# Altium project AQM with esp32.PrjPcb
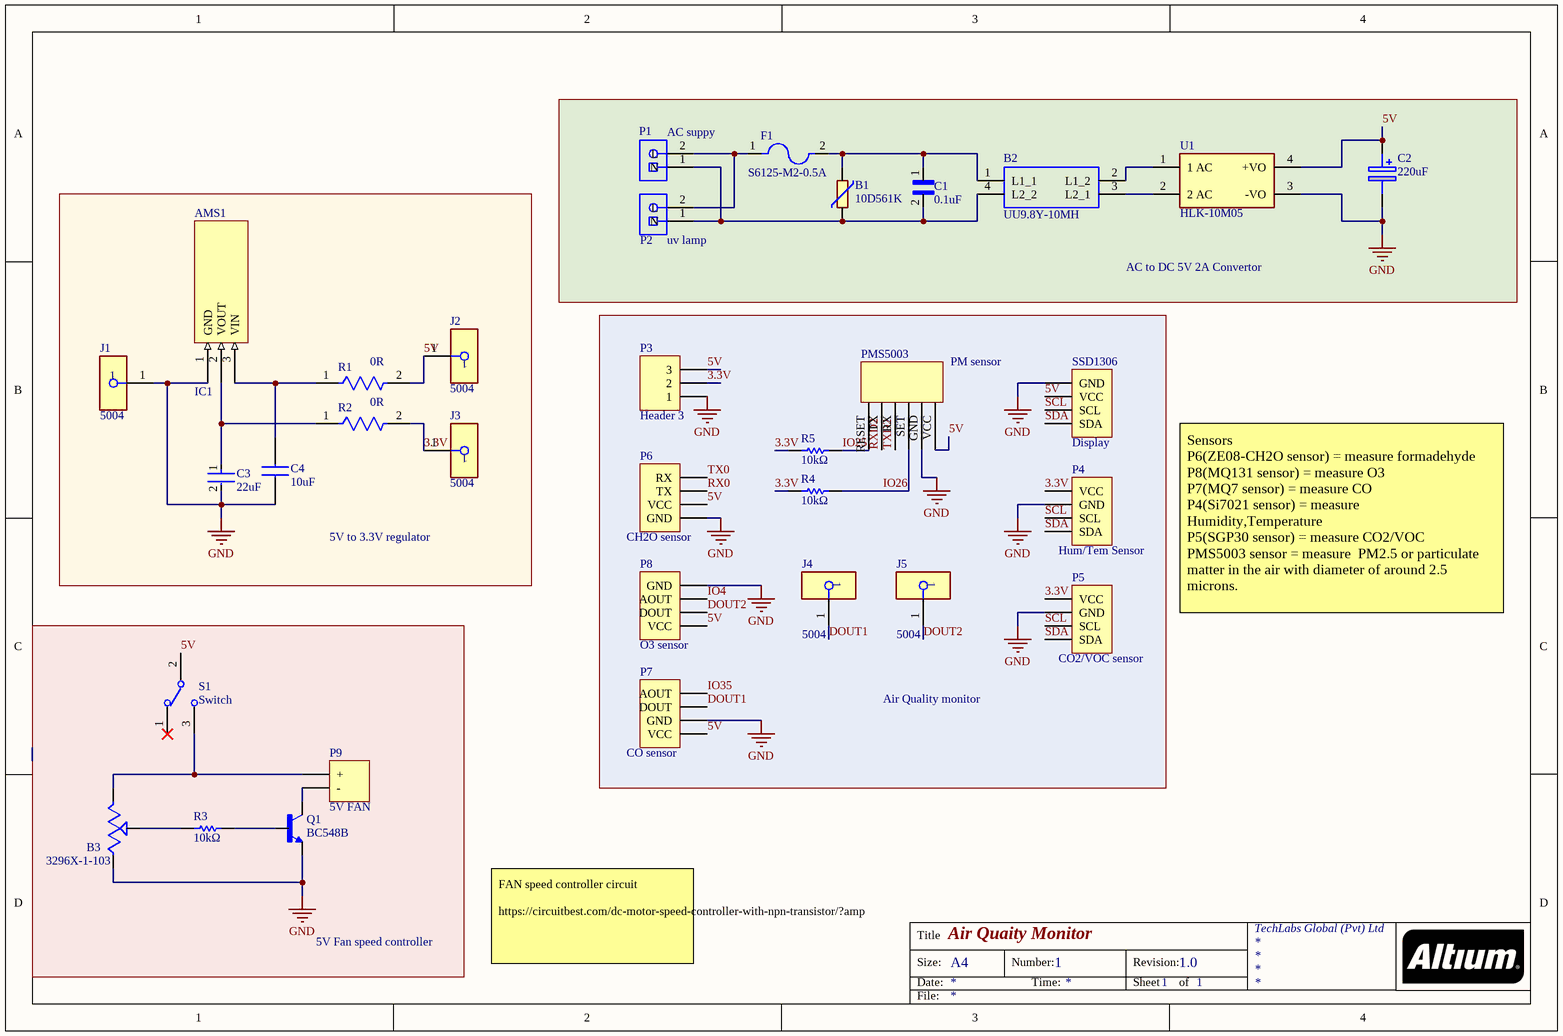
[diagram p0: AQM with esp32.SchDoc]
2 sheets, 72 parts. Net scope: global (net labels, ports and power ports of the same name join across sheets).
Board file: AQM with esp32.PcbDoc
Sheets:
  AQM with esp32.SchDoc
  ESP32 module desing.SchDoc

## Sheet AQM with esp32.SchDoc: Air Quaity Monitor
size A4; Organization: TechLabs Global (Pvt) Ltd; DocumentNumber: 1; Revision: 1.0; SheetNumber: 1; SheetTotal: 1

### Parts
AMS1  IC1  [SOT89-150P350X150-3N]
B1  10D561K  [10D561K]
B2  UU9.8Y-10MH  [UU98Y10MH]
B3  3296X-1-103  [3296X1223LF]
C1  0.1uF  [MPX-104K275VAC-C-D2]
C2  220uF  [CAPAE830X1050N]
C3  22uF  [FP-GRM219-0_2-0_15-IPC_A]
C4  10uF  [CAPC1005X70N]
F1  S6125-M2-0.5A  [CAPC6125X25N]
J1  5004  [FP-5004-MFG]
J2  5004  [FP-5004-MFG]
J3  5004  [FP-5004-MFG]
J4  5004  [FP-5004-MFG]
J5  5004  [FP-5004-MFG]
P1  AC suppy  [PHOE-1729128-2_V]
P2  uv lamp  [PHOE-1729128-2_V]
P3  Header 3  [HDR1X3]
P4  Hum/Tem Sensor  [HDR1X4]
P5  CO2/VOC sensor  [HDR1X4]
P6  CH2O sensor  [HDR1X4]
P7  CO sensor  [HDR1X4]
P8  O3 sensor  [HDR1X4]
P9  5V FAN  [HDR1X2]
PMS5003  PM sensor  [PMS5003 PM2.5 Sensor]
Q1  BC548B  [BC548B]
R1  0R  [FP-RC0402-0_4-IPC_A]
R2  0R  [FP-RC0402-0_4-IPC_A]
R3  10kΩ  [RESC1005X40X25LL05T10]
R4  10kΩ  [RESC1005X40X25LL05T10]
R5  10kΩ  [RESC1005X40X25LL05T10]
S1  Switch  [SK3245SL1A]
SSD1306  Display  [HDR1X4]
U1  HLK-10M05  [FP-HLK-10M05-MFG]

### Blocks framed on the sheet
AC to DC 5V 2A Convertor: B1 B2 C1 C2 F1 P1 P2 U1
5V to 3.3V regulator: AMS1 C3 C4 J1-J3 R1 R2
Air Quality monitor: J4 J5 P3-P8 PMS5003 R4 R5 SSD1306
5V Fan speed controller: B3 P9 Q1 R3 S1

### Nets
GND: AMS1.1(GND) B3.1(A) C2.2(-) C3.2 C4.1 J1.1 P3.1 P4.2(GND) P5.2(GND) P6.1(GND) P7.2(GND) P8.4(GND) PMS5003.GND Q1.3(E) SSD1306.1(GND) U1.3(-VO)
3.3V: J3.1 P3.2 P4.1(VCC) P5.1(VCC) R2.2 R4.1 R5.1
5V: C2.1(+) J2.1 P3.3 P6.2(VCC) P7.1(VCC) P8.1(VCC) PMS5003.VCC R1.2 S1.2 SSD1306.2(VCC) U1.4(+VO)
DOUT1: J4.1 P7.3(DOUT)
DOUT2: J5.1 P8.2(DOUT)
IO4: P8.3(AOUT)
IO25: PMS5003.RESET R5.2
IO26: PMS5003.SET R4.2
IO35: P7.4(AOUT)
RX0: P6.3(TX)
RXD2: PMS5003.TX
SCL: P4.3(SCL) P5.3(SCL) SSD1306.3(SCL)
SDA: P4.4(SDA) P5.4(SDA) SSD1306.4(SDA)
TX0: P6.4(RX)
TXD2: PMS5003.RX
NetAMS1_2: AMS1.2(VOUT) C3.1 R2.1
NetAMS1_3: AMS1.3(VIN) C4.2 R1.1
NetB1_1: B1.1 B2.1(L1_1) C1.1 F1.2
NetB1_2: B1.2 B2.4(L2_2) C1.2 P1.1(N) P2.1(N)
NetB2_2: B2.2(L1_2) U1.1(1_AC)
NetB2_3: B2.3(L2_1) U1.2(2_AC)
NetB3_2: B3.2(B) R3.1
NetB3_3: B3.3(C) P9.1(+) S1.3
NetF1_1: F1.1 P1.2(L) P2.2(L)
NetP9_2: P9.2(-) Q1.1(C)
NetQ1_2: Q1.2(B) R3.2

Not connected (* = marked no-connect by the designer): S1 1*

### Notes on the sheet
- Sensors
  P6(ZE08-CH2O sensor) = measure formadehyde
  P8(MQ131 sensor) = measure O3
  P7(MQ7 sensor) = measure CO
  P4(Si7021 sensor) = measure Humidity,Temperature
  P5(SGP30 sensor) = measure CO2/VOC
  PMS5003 sensor = measure  PM2.5 or particulate matter in the air with diameter of around 2.5 microns.
- FAN speed controller circuit
  https://circuitbest.com/dc-motor-speed-controller-with-npn-transistor/?amp
- Title
- Size:
- Date:
- A4
- Number:
- Time:
- Revision:
- Sheet
- of
- File:

### Library data of the parts
AMS1 = IC?: 75dB@(120Hz) 1A 1.25V@(1A) ±125℃@(Tj) Fixed 3.3V~3.3V Positive 1 20V SOT-89 Linear Voltage Regulators (LDO) ROHS; Manufacturer: YONGYUTAI; Mfr. Part #: AMS1117-3.3; LCSC Part #: C2904742; Package: SOT-89; Datasheet: https://datasheet.lcsc.com/lcsc/2110121330_YONGYUTAI-AMS1117-3-3_C2904742.pdf
B1 = 10D561K: 920V 42.3J 180pF@1kHz 460V 350V 504V~616V 2.5kA Plugin Varistors ROHS; Manufacturer: Hongzhi Elec; Datasheet: https://datasheet.lcsc.com/lcsc/1811141751_Hongzhi-Elec-10D561K_C113236.pdf; LCSC Part #: C113236; Mfr. Part #: 10D561K; Package: Plugin
B2 = UU9.8Y-10MH: 10mH@1kHz 1.2Ω 2 500mA 50V Plugin Common Mode Filters ROHS; Manufacturer: FH (Guangdong Fenghua Advanced Tech); Mfr.Part #: UU9.8Y-10MH; Package: Plugin; Datasheet: https://datasheet.lcsc.com/lcsc/1810311213_FH--Guangdong-Fenghua-Advanced-Tech-UU9-8Y-10mH_C75192.pdf; LCSC Part#: C75192
B3 = 3296X-1-103: ±10% 10kΩ Plugin Variable Resistors/Potentiometers ROHS; Manufacturer: BOCHEN(Chengdu Guosheng Tech); Mfr. Part #: 3296X-1-103; Package: Plugin; LCSC Part #: C118955; Datasheet: https://datasheet.lcsc.com/lcsc/1811011704_BOCHEN-Chengdu-Guosheng-Tech-3296X-1-103_C118955.pdf
C1 = MPX-104K275VAC-C-D2: 0.1uF ±10% -40℃~+110℃ X2 275VAC Radial Leaded,P=15mm Suppression Capacitors ROHS; Manufacturer: CORETONG; LCSC Part #: C3249976; Package: Radial Leaded,P=15mm; Datasheet: https://datasheet.lcsc.com/lcsc/2207051802_CORETONG-MPX-104K275VAC-C-D2_C3249976.pdf; Mfr. Part #: MPX-104K275VAC-C-D2; Value: 0.1uF
C2 = UUR1C221MNL1GS: -40℃~+85℃ 2000hrs@85℃ 220uF 10mm 16V 8mm 215mA@120Hz ±20% SMD,D8xL10mm Aluminum Electrolytic Capacitors - SMD ROHS; Manufacturer: Nichicon; Mfr.Part #: UUR1C221MNL1GS; Package: SMD,D8xL10mm; Datasheet: https://datasheet.lcsc.com/lcsc/2002121532_Nichicon-UUR1C221MNL1GS_C445237.pdf; LCSC Part#: C445237; Value: 220uF
C3 = CMP-06035-056251-1: Chip Multilayer Ceramic Capacitors for General Purpose, 0805, 22uF, X5R, 15%, 20%, 16V; Mfr. Part #: GRM219R61C226ME15L; Manufacturer: Murata Electronics; value: 22uF; Datasheet: https://datasheet.lcsc.com/lcsc/1811141821_Murata-Electronics-GRM219R61C226ME15L_C162295.pdf; LCSC Part #: C162295; Package: 0805
C4 = CL05A106MQ5NUNC: 6.3V 10uF X5R ±20% 0402 Multilayer Ceramic Capacitors MLCC - SMD/SMT ROHS; Manufacturer: Samsung Electro-Mechanics; Mfr. Part #: CL05A106MQ5NUNC; LCSC Part #: C15525; value: 10uF; Datasheet Link: https://datasheet.datasheetarchive.com/originals/distributors/Datasheets-DGA10/2406160.pdf; Package: 0402
F1 = S6125-M2-0.5A: SMD Fuses ROHS; Manufacturer: SART(Nanjing Sart Tech); LCSC Part #: C845172; Mfr. Part #: S6125-M2-0.5A; Package: SMD; Datasheet: https://datasheet.lcsc.com/lcsc/2201242130_SART-Nanjing-Sart-Tech-S6125-M2-0-5A_C845172.pdf
J1-J5 = CMP-2000-05575-2: PC TEST POINT MINIATURE YELLOW; Manufacturer: Keystone; Datasheet: https://datasheet.lcsc.com/lcsc/2201121200_Keystone-5004_C2906762.pdf; LCSC Part #: C2906762; ComponentLink2URL: https://www.keyelco.com/product-pdf.cfm?p=1313; ComponentLink2Description: Datasheet; Package: 5004; Mfr. Part #: 5004
P1 P2 = CMP-2000-05815-1: 13.5A 400V Green Straight pin 5.08mm 1 2 Plugin,P=5.08mm Screw terminal ROHS; Mfr.Part #: 1729128; Manufacturer: Phoenix Contact; Datasheet: https://www.farnell.com/datasheets/2617011.pdf; LCSC Part#: C91153; Package: Plugin,P=5.08mm
P3 = Header 3: Header, 3-Pin; LatestRevisionDate: 17-Jul-2002; LatestRevisionNote: Re-released for DXP Platform.; Publisher: Altium Limited
P4 = Header 4: Si7021 Header, 4-Pin
P5 = Header 4: SGP30 Header, 4-Pin; LatestRevisionDate: 17-Jul-2002; LatestRevisionNote: Re-released for DXP Platform.; Publisher: Altium Limited
P6 = Header 4: - Sensor Modules ROHS; Mfr.Part #: ZE08-CH2O; Manufacturer: Zhengzhou Winsen Elec Tech; LCSC Part#: C141344
P7 = Header 4: MQ7 Header, 4-Pin; LatestRevisionDate: 17-Jul-2002; LatestRevisionNote: Re-released for DXP Platform.; Publisher: Altium Limited
P8 = Header 4: MQ131 Header, 4-Pin; LatestRevisionDate: 17-Jul-2002; LatestRevisionNote: Re-released for DXP Platform.; Publisher: Altium Limited
P9 = Header 2: Header, 2-Pin; LatestRevisionDate: 17-Jul-2002; LatestRevisionNote: Re-released for DXP Platform.; Publisher: Altium Limited
PMS5003 = PMS5003 PM2.5 Sensor: PMS5003 Sensor Modules ROHS; Manufacturer: Beijing Plantower; Mfr.Part #: PMS5003; LCSC Part#: C91431; Package: PMS5003; Datasheet: https://datasheet.lcsc.com/lcsc/1810251510_Beijing-Plantower-PMS5003_C91431.pdf
Q1 = BC548B: 100nA 30V 625mW 200@2mA,5V 100mA 150MHz 300mV@100mA,5mA NPN +150℃@(Tj) TO-92-3 Bipolar Transistors - BJT ROHS; Manufacturer: LGE; LCSC Part#: C713615; Mfr.Part #: BC548B; Package: TO-92-3; Datasheet: https://datasheet.lcsc.com/lcsc/2008011835_LGE-BC548B_C713615.pdf
R1 R2 = CMP-2002-07342-2: RES SMD 0 OHM JUMPER 1/16W 0402; Manufacturer: Yageo; Mfr. Part #: RC0402FR-070RL; value: 0R; Package: 0402; LCSC Part #: C106231; Datasheet: https://www.lcsc.com/product-detail/Chip-Resistor-Surface-Mount_YAGEO-RC0402FR-070RL_C106231.html
R3-R5 = CMP-2002-07353-1: 62.5mW 50V ±100ppm/℃ ±1% -55℃~+155℃ 10kΩ 0402 Chip Resistor - Surface Mount ROHS; Mfr. Part #: RC0402FR-0710KL; Manufacturer: Yageo / Phycomp; Datasheet: https://datasheet.lcsc.com/lcsc/1809301715_YAGEO-RC0402FR-0710KL_C60490.pdf; LCSC Part #: C60490; Package: 0402; value: 10kΩ
S1 = SK-3245S-L1-A: Surface Mount 50mA DPDT 3.2mm 12V 9.1mm 12V 3.55mm 50mA 10000 SMDSplicing Rectangular columnar -40℃~+85℃ Black SMD Slide Switches ROHS; Manufacturer: XKB Connectivity; Package: SMD; Datasheet: https://datasheet.lcsc.com/lcsc/2002271841_XKB-Connectivity-SK-3245S-L1-A_C405951.pdf; Mfr. Part #: SK-3245S-L1-A; LCSC Part #: C405951
SSD1306 = Header 4: Header, 4-Pin; LatestRevisionDate: 17-Jul-2002; LatestRevisionNote: Re-released for DXP Platform.; Publisher: Altium Limited
U1 = CMP-218581-000001-1: 5V 2A 90VAC~265VAC 1 120V~350V Isolated Regulated 10W AC-DC 80% Plugin Power Modules ROHS; Manufacturer: HI-LINK; Mfr.Part #: HLK-10M05; LCSC Part#: C403745; Package: Plugin

## Sheet ESP32 module desing.SchDoc
size A4
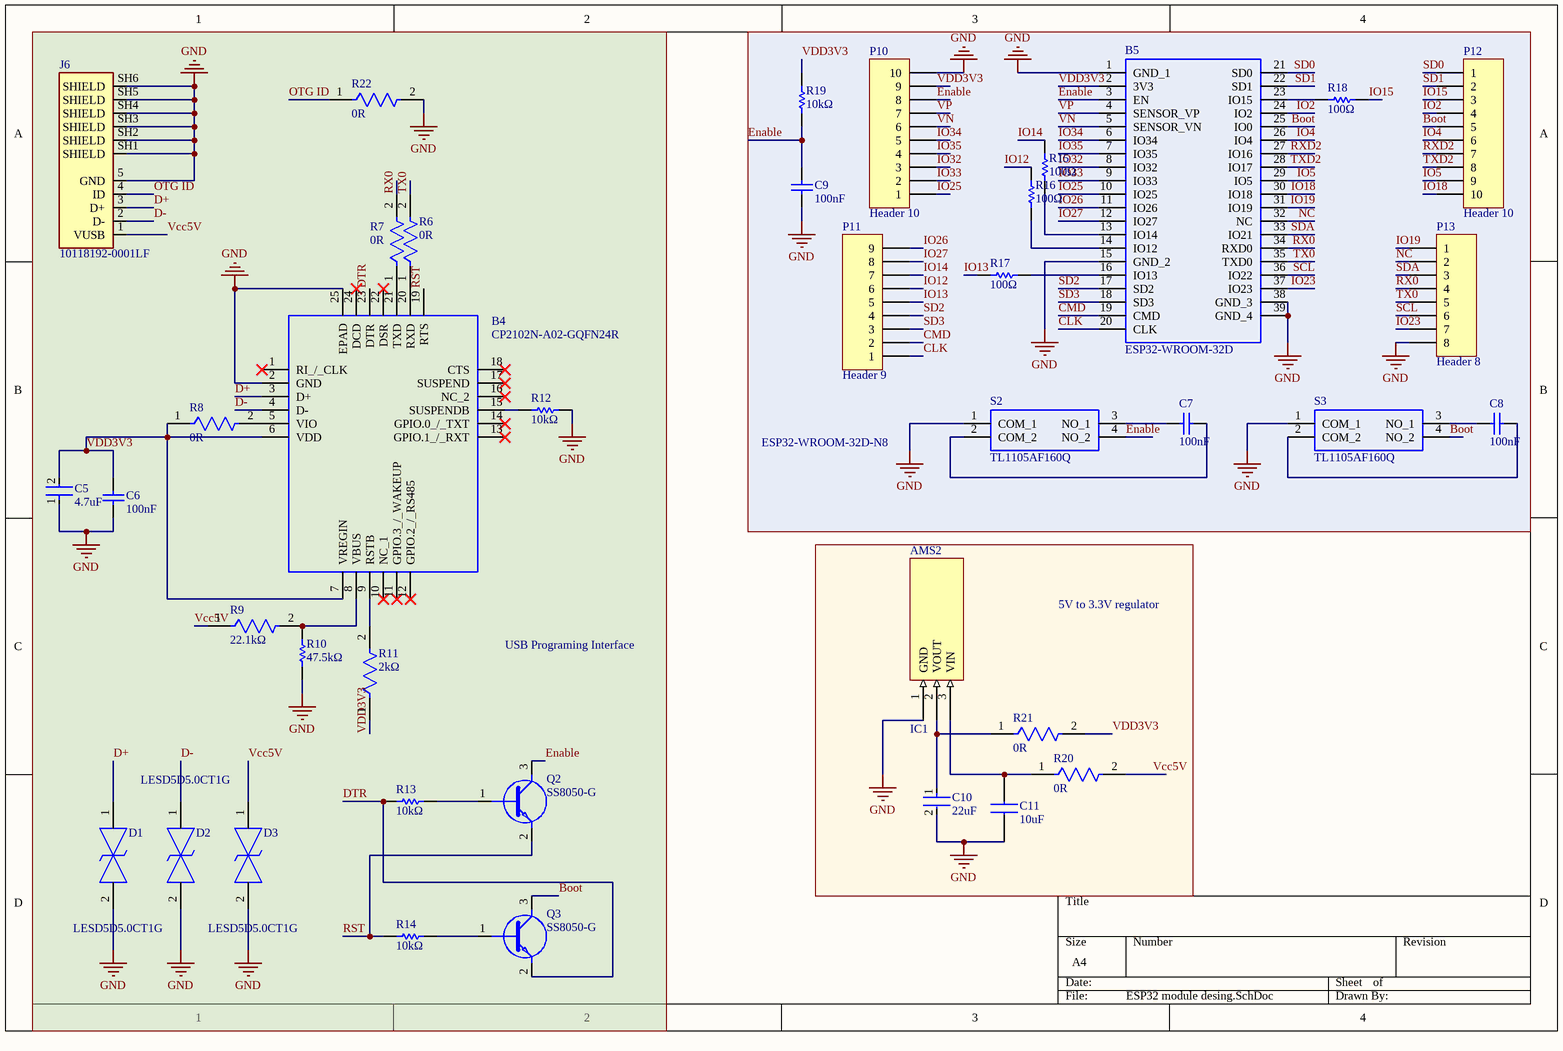
[diagram p1: ESP32 module desing.SchDoc]

### Parts
AMS2  IC1  [SOT89-150P350X150-3N]
B4  CP2102N-A02-GQFN24R  [QFN50P400X400X80-25N-D]
B5  ESP32-WROOM-32D  [ESP32WROOM32D]
C5  4.7uF  [FP-CL21-IPC_A]
C6  100nF  [CAPC1050X55X23ML05T13]
C7  100nF  [CAPC1050X55X23ML05T13]
C8  100nF  [CAPC1050X55X23ML05T13]
C9  100nF  [CAPC1050X55X23ML05T13]
C10  22uF  [FP-GRM219-0_2-0_15-IPC_A]
C11  10uF  [CAPC1005X70N]
D1  LESD5D5.0CT1G  [LESD5D50CT1G]
D2  LESD5D5.0CT1G  [LESD5D50CT1G]
D3  LESD5D5.0CT1G  [LESD5D50CT1G]
J6  10118192-0001LF  [AMPHENOL_10118192-0001LF]
P10  Header 10  [HDR1X10]
P11  Header 9  [HDR1X9]
P12  Header 10  [HDR1X10]
P13  Header 8  [HDR1X8]
Q2  SS8050-G  [SOT95P240X115-3N]
Q3  SS8050-G  [SOT95P240X115-3N]
R6  0R  [FP-RC0402-0_4-IPC_A]
R7  0R  [FP-RC0402-0_4-IPC_A]
R8  0R  [FP-RC0402-0_4-IPC_A]
R9  22.1kΩ  [FP-RC0402-0_4-IPC_B]
R10  47.5kΩ  [RESC1005X40X25NL05T10]
R11  2kΩ  [FP-RC_L0402-MFG]
R12  10kΩ  [RESC1005X40X25LL05T10]
R13  10kΩ  [RESC1005X40X25LL05T10]
R14  10kΩ  [RESC1005X40X25LL05T10]
R15  100Ω  [RESC1005X40X25ML05T10]
R16  100Ω  [RESC1005X40X25ML05T10]
R17  100Ω  [RESC1005X40X25ML05T10]
R18  100Ω  [RESC1005X40X25ML05T10]
R19  10kΩ  [RESC1005X40X25LL05T10]
R20  0R  [FP-RC0402-0_4-IPC_A]
R21  0R  [FP-RC0402-0_4-IPC_A]
R22  0R  [FP-RC0402-0_4-IPC_A]
S2  TL1105AF160Q  [TL1105AF160Q]
S3  TL1105AF160Q  [TL1105AF160Q]

### Blocks framed on the sheet
USB Programing Interface: B4 C5 C6 D1-D3 J6 Q2 Q3 R6-R14 R22
ESP32-WROOM-32D-N8: B5 C7-C9 P10-P13 R15-R19 S2 S3
5V to 3.3V regulator: AMS2 C10 C11 R20 R21

### Nets
GND: AMS2.1(GND) B4.2(GND) B4.25(EPAD) B5.1(GND_1) B5.15(GND_2) B5.38(GND_3) B5.39(GND_4) C5.1 C6.1 C9.2 C10.2 C11.1 D1.2 D2.2 D3.2 J6.5(GND) J6.SH1(SHIELD) J6.SH2(SHIELD) J6.SH3(SHIELD) J6.SH4(SHIELD) J6.SH5(SHIELD) J6.SH6(SHIELD) P10.10 P13.8 R10.1 R12.2 R22.2 S2.1(COM_1) S3.1(COM_1)
Boot: B5.25(IO0) P12.5 Q3.3(C) S3.4(NO_2)
CLK: B5.20(CLK) P11.1
CMD: B5.19(CMD) P11.2
D+: B4.3(D+) D1.1 J6.3(D+)
D-: B4.4(D-) D2.1 J6.2(D-)
DTR: B4.23(DTR) Q3.2(E) R13.1
Enable: B5.3(EN) C9.1 P10.8 Q2.3(C) R19.1 S2.4(NO_2)
IO2: B5.24(IO2) P12.4
IO4: B5.26(IO4) P12.6
IO5: B5.29(IO5) P12.9
IO12: P11.6 R16.2
IO13: P11.5 R17.1
IO14: P11.7 R15.2
IO15: P12.3 R18.2
IO18: B5.30(IO18) P12.10
IO19: B5.31(IO19) P13.1
IO23: B5.37(IO23) P13.7
IO25: B5.10(IO25) P10.1
IO26: B5.11(IO26) P11.9
IO27: B5.12(IO27) P11.8
IO32: B5.8(IO32) P10.3
IO33: B5.9(IO33) P10.2
IO34: B5.6(IO34) P10.5
IO35: B5.7(IO35) P10.4
NC: B5.32(NC) P13.2
OTG ID: J6.4(ID) R22.1
RST: B4.19(RTS) Q2.2(E) R14.1
RX0: B5.34(RXD0) P13.4 R7.2
RXD2: B5.27(IO16) P12.7
SCL: B5.36(IO22) P13.6
SD0: B5.21(SD0) P12.1
SD1: B5.22(SD1) P12.2
SD2: B5.17(SD2) P11.4
SD3: B5.18(SD3) P11.3
SDA: B5.33(IO21) P13.3
TX0: B5.35(TXD0) P13.5 R6.2
TXD2: B5.28(IO17) P12.8
Vcc5V: D3.1 J6.1(VUSB) R9.1 R20.2
VDD3V3: B4.6(VDD) B4.7(VREGIN) B5.2(3V3) C5.2 C6.2 P10.9 R8.1 R11.1 R19.2 R21.2
VN: B5.5(SENSOR_VN) P10.6
VP: B5.4(SENSOR_VP) P10.7
NetAMS2_2: AMS2.2(VOUT) C10.1 R21.1
NetAMS2_3: AMS2.3(VIN) C11.2 R20.1
NetB4_5: B4.5(VIO) R8.2
NetB4_8: B4.8(VBUS) R9.2 R10.2
NetB4_9: B4.9(RSTB) R11.2
NetB4_15: B4.15(SUSPENDB) R12.1
NetB4_20: B4.20(RXD) R6.1
NetB4_21: B4.21(TXD) R7.1
NetB5_13: B5.13(IO14) R15.1
NetB5_14: B5.14(IO12) R16.1
NetB5_16: B5.16(IO13) R17.2
NetB5_23: B5.23(IO15) R18.1
NetC7_1: C7.1 S2.2(COM_2)
NetC7_2: C7.2 S2.3(NO_1)
NetC8_1: C8.1 S3.2(COM_2)
NetC8_2: C8.2 S3.3(NO_1)
NetQ2_1: Q2.1(B) R13.2
NetQ3_1: Q3.1(B) R14.2

Not connected (* = marked no-connect by the designer): B4 1(RI_/_CLK)* 10(NC_1)* 11(GPIO.3_/_WAKEUP)* 12(GPIO.2_/_RS485)* 13(GPIO.1_/_RXT)* 14(GPIO.0_/_TXT)* 16(NC_2)* 17(SUSPEND)* 18(CTS)* 22(DSR)* 24(DCD)*

### Library data of the parts
AMS2 = IC?: as AMS1 on sheet AQM with esp32; LCSC Part #: C2904742; Package: SOT-89; Datasheet: https://datasheet.lcsc.com/lcsc/2110121330_YONGYUTAI-AMS1117-3-3_C2904742.pdf
B4 = CP2102N-A02-GQFN24R: USB Interface IC USB to UART bridge - QFN24; Manufacturer: SILICON LABS; Mfr.Part #: CP2102N-A02-GQFN24R; LCSC Part#: C969151; Datasheet: https://datasheet.lcsc.com/lcsc/2201131400_SILICON-LABS-CP2102N-A02-GQFN24R_C969151.pdf; Package: QFN-24-EP(4x4)
B5 = ESP32-WROOM-32D: WiFi Modules (802.11) SMD Module, ESP32-D0WD, 32Mbits SPI flash, UART mode, PCB antenna; Manufacturer_Name: Espressif Systems; Geometry.Height: 3.1mm; Manufacturer_Part_Number: ESP32-WROOM-32D; Mouser Part Number: N/A; Mouser Price/Stock: https://www.mouser.co.uk/ProductDetail/Espressif-Systems/ESP32-WROOM-32D?qs=MLItCLRbWszx2KabkKPu5A%3D%3D; Arrow Part Number: *; Arrow Price/Stock: *; Mouser Testing Part Number: *; Mouser Testing Price/Stock: *; Datasheet Link: https://www.mouser.com/datasheet/2/891/esp32-wroom-32d_esp32-wroom-32u_datasheet_en-1365844.pdf
C5 = CMP-13271-002624-1: X5R 25V 4.7uF ±10% 0805 Multilayer Ceramic Capacitors MLCC - SMD/SMT ROHS; Mfr.Part #: CL21A475KAQNNNE; Manufacturer: Samsung Electro-Mechanics; LCSC Part#: C1779; Value: 4.7uF; Package: 0805; Datasheet: https://datasheet.lcsc.com/lcsc/1810261822_Samsung-Electro-Mechanics-CL21A475KAQNNNE_C1779.pdf
C6-C9 = CMP-2000-05439-1: X7R 100nF 16V ±10% 0402 Multilayer Ceramic Capacitors MLCC - SMD/SMT ROHS; Manufacturer: Samsung Electro-Mechanics; Mfr.Part #: CL05B104KO5NNNC; Package: 0402; Value: 100nF; Datasheet: https://datasheet.lcsc.com/lcsc/1810191219_Samsung-Electro-Mechanics-CL05B104KO5NNNC_C1525.pdf; LCSC Part#: C1525
C10 = CMP-06035-056251-1: as C3 on sheet AQM with esp32; value: 22uF; Datasheet: https://datasheet.lcsc.com/lcsc/1811141821_Murata-Electronics-GRM219R61C226ME15L_C162295.pdf; LCSC Part #: C162295; Package: 0805
C11 = CL05A106MQ5NUNC: as C4 on sheet AQM with esp32; Mfr. Part #: CL05A106MQ5NUNC; LCSC Part #: C15525; value: 10uF; Datasheet Link: https://datasheet.datasheetarchive.com/originals/distributors/Datasheets-DGA10/2406160.pdf; Package: 0402
D1-D3 = LESD5D5.0CT1G: Transient Voltage Suppressors for ESD Protection; Manufacturer: UMW(Youtai Semiconductor Co., Ltd.); Mfr.Part #: LESD5D5.0CT1G; Datasheet: https://datasheet.lcsc.com/lcsc/2210171730_UMW-Youtai-Semiconductor-Co---Ltd--LESD5D5-0CT1G_C5199850.pdf; Package: SOD-523; LCSC Part#: C5199850
J6 = 10118192-0001LF: Single Port 5 Contact Horizontal Right Angle Shielded Micro B USB 2.0 Connector; Manufacturer: Amphenol ICC; Mfr.Part #: 10118192-0001LF; Package: SMD; LCSC Part#: C132564; Datasheet: https://datasheet.lcsc.com/lcsc/2111290930_Amphenol-ICC-10118192-0001LF_C132564.pdf
P10 P12 = Header 10: Header, 10-Pin; LatestRevisionDate: 17-Jul-2002; LatestRevisionNote: Re-released for DXP Platform.; Publisher: Altium Limited
P11 = Header 9: Header, 9-Pin; LatestRevisionDate: 17-Jul-2002; LatestRevisionNote: Re-released for DXP Platform.; Publisher: Altium Limited
P13 = Header 8: Header, 8-Pin; LatestRevisionDate: 17-Jul-2002; LatestRevisionNote: Re-released for DXP Platform.; Publisher: Altium Limited
Q2 Q3 = SS8050-G: 100nA 25V 300mW 200@100mA,1V 1.5A 100MHz 500mV@800mA,80mA NPN +150℃@(Tj) SOT-23 Bipolar Transistors - BJT ROHS; Manufacturer: Jiangsu Changjing Electronics Technology Co., Ltd.; LCSC Part#: C164885; Package: SOT-23; Mfr.Part #: SS8050-G; Datasheet: https://datasheet.lcsc.com/lcsc/1809211025_Jiangsu-Changjing-Electronics-Technology-Co---Ltd--SS8050-G_C164885.pdf
R6-R8 R20-R22 = CMP-2002-07342-2: as R1 on sheet AQM with esp32; value: 0R; Package: 0402; LCSC Part #: C106231; Datasheet: https://www.lcsc.com/product-detail/Chip-Resistor-Surface-Mount_YAGEO-RC0402FR-070RL_C106231.html
R9 = CMP-2002-07515-2: RES 22.1K OHM 1% 1/16W 0402; Manufacturer: YAGEO; Mfr.Part #: RC0402FR-0722K1L; Datasheet: https://datasheet.lcsc.com/lcsc/1810241338_YAGEO-RC0402FR-0722K1L_C163478.pdf; LCSC Part#: C163478; Package: 0402; Value: 22.1kΩ
R10 = CMP-1011-00700-2: Mfr.Part #: RC0402FR-0747K5L; Manufacturer: YAGEO; LCSC Part#: C137974; Package: 0402; Datasheet: https://datasheet.lcsc.com/lcsc/1810241332_YAGEO-RC0402FR-0747K5L_C137974.pdf; Value: 47.5kΩ
R11 = CMP-2002-07580-2: 62.5mW Thick Film Resistors 50V ±100ppm/℃ ±1% -55℃~+155℃ 2kΩ 0402 Chip Resistor - Surface Mount ROHS; Manufacturer: YAGEO; Mfr.Part #: RESC10050X35; LCSC Part#: C60488; Package: 0402; ComponentLink2Description: Datasheet; ComponentLink2URL: http://www.yageo.com/documents/recent/PYu-RC_Group_51_RoHS_L_9.pdf; Value: 2kΩ
R12-R14 R19 = CMP-2002-07353-1: 50V 10kΩ Thick Film Resistors 62.5mW ±1% -55℃~+155℃ ±100ppm/℃ 0402 Chip Resistor - Surface Mount ROHS; Mfr.Part #: RC0402FR-0710KL; Manufacturer: YAGEO; Value: 10kΩ; LCSC Part#: C60490; Package: 0402
R15-R18 = CMP-2002-07344-1: 100Ω 62.5mW 50V ±1% -55℃~+155℃ ±100ppm/℃ 0402 Chip Resistor - Surface Mount ROHS; Mfr.Part #: RC0402FR-07100RL; Manufacturer: YAGEO; Value: 100Ω; LCSC Part#: C2935235; Package: 0402; Datasheet: https://datasheet.lcsc.com/lcsc/2201121700_YAGEO-RC0402FR-07100RL_C2935235.pdf
S2 S3 = TL1105AF160Q: 6mm 1.4mm Round Button 50mA Straight 6mm SPST 12V Plugin,6x6mm Tactile Switches ROHS; Manufacturer: E-Switch; Mfr.Part #: TL1105AF160Q; Package: Plugin,6x6mm; LCSC Part#: C273465; Datasheet: https://datasheet.lcsc.com/lcsc/1809291031_E-Switch-TL1105AF160Q_C273465.pdf

## Nets that join several sheets
GND: AQM with esp32 (16 pins), ESP32 module desing (29 pins)
IO4: AQM with esp32 (P8.3), ESP32 module desing (B5.26 P12.6)
IO25: AQM with esp32 (PMS5003.RESET R5.2), ESP32 module desing (B5.10 P10.1)
IO26: AQM with esp32 (PMS5003.SET R4.2), ESP32 module desing (B5.11 P11.9)
IO35: AQM with esp32 (P7.4), ESP32 module desing (B5.7 P10.4)
RX0: AQM with esp32 (P6.3), ESP32 module desing (B5.34 P13.4 R7.2)
RXD2: AQM with esp32 (PMS5003.TX), ESP32 module desing (B5.27 P12.7)
SCL: AQM with esp32 (P4.3 P5.3 SSD1306.3), ESP32 module desing (B5.36 P13.6)
SDA: AQM with esp32 (P4.4 P5.4 SSD1306.4), ESP32 module desing (B5.33 P13.3)
TX0: AQM with esp32 (P6.4), ESP32 module desing (B5.35 P13.5 R6.2)
TXD2: AQM with esp32 (PMS5003.RX), ESP32 module desing (B5.28 P12.8)